# EAGLE design Boron_Feather32_Soil Carrier 200 19Apr2020c (EAGLE 9.6.0)

## Sheet 1 of 3: Sensors
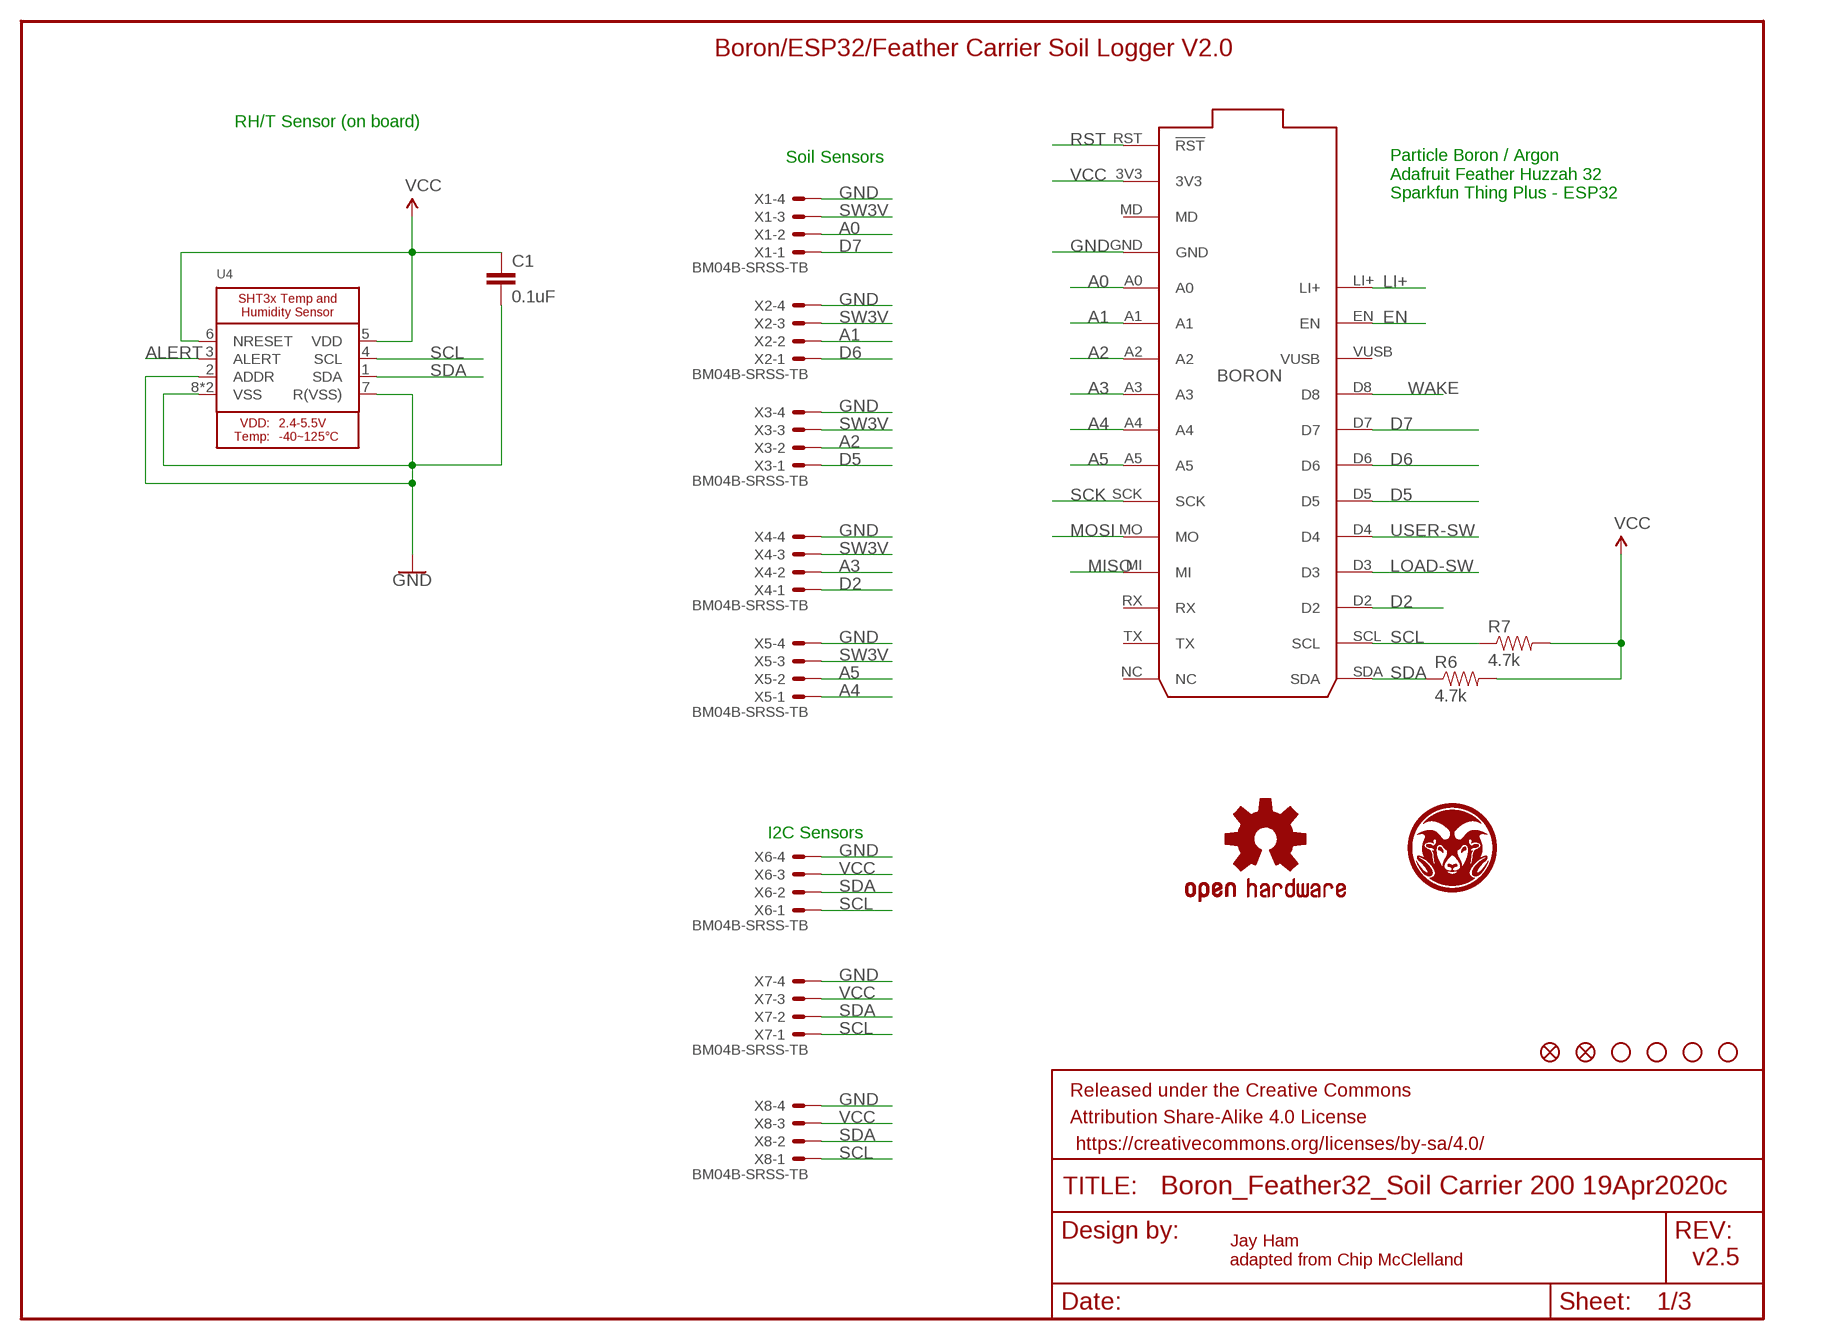
[diagram p0: schematic, sheet 1]

### Parts
BORON  PARTICLE-DEVICES-BORON  [PARTICLE-DEVICES_BORON]
C1  0.1uF  CAP0805  [0805]
FD1  FIDUCIALUFIDUCIAL  [FIDUCIAL-MICRO]
FD2  FIDUCIALUFIDUCIAL  [FIDUCIAL-MICRO]
FRAME1  FRAME-LETTER  [CREATIVE_COMMONS]
JP10  STAND-OFF  [STAND-OFF]
JP11  STAND-OFF  [STAND-OFF]
JP12  STAND-OFF  [STAND-OFF]
JP13  STAND-OFF  [STAND-OFF]
LOGO1  OSHW-LOGOM  [OSHW-LOGO-M]
R6  4.7k  RESISTOR0805-RES  [0805]
R7  4.7k  RESISTOR0805-RES  [0805]
U4  MICROBUILDER_SHT3X  [MICROBUILDER_SHT3X]
U$1  CSU-RAM-LOGO7MM  [CSU-RAM-7MM]
X1  BM04B-SRSS-TB  [BM04B-SRSS-TB]
X2  BM04B-SRSS-TB  [BM04B-SRSS-TB]
X3  BM04B-SRSS-TB  [BM04B-SRSS-TB]
X4  BM04B-SRSS-TB  [BM04B-SRSS-TB]
X5  BM04B-SRSS-TB  [BM04B-SRSS-TB]
X6  BM04B-SRSS-TB  [BM04B-SRSS-TB]
X7  BM04B-SRSS-TB  [BM04B-SRSS-TB]
X8  BM04B-SRSS-TB  [BM04B-SRSS-TB]

### Nets
A0: BORON.A0 X1.2
A1: BORON.A1 X2.2
A2: BORON.A2 X3.2
A3: BORON.A3 X4.2
A4: BORON.A4 X5.1
A5: BORON.A5 X5.2
ALERT: U4.3(ALERT)
D2: BORON.D2 X4.1
D5: BORON.D5 X3.1
D6: BORON.D6 X2.1
D7: BORON.D7 X1.1
EN: BORON.EN ; also sheet 3
GND [supply]: BORON.GND C1.2 U4.2(ADDR) U4.7(R(VSS)) U4.8(VSS) U4.THERMAL(VSS) X1.4 X2.4 X3.4 X4.4 X5.4 X6.4 X7.4 X8.4 ; also sheet 2,3
LI+ [supply]: BORON.LI+ ; also sheet 2
LOAD-SW: BORON.D3 ; also sheet 2,3
MISO: BORON.MI
MOSI: BORON.MO
RST: BORON.RST(!RST) ; also sheet 3
SCK: BORON.SCK
SCL: BORON.SCL R7.1 U4.4(SCL) X6.1 X7.1 X8.1 ; also sheet 2,3
SDA: BORON.SDA R6.1 U4.1(SDA) X6.2 X7.2 X8.2 ; also sheet 2,3
SW3V [supply]: X1.3 X2.3 X3.3 X4.3 X5.3 ; also sheet 2
USER-SW: BORON.D4 ; also sheet 2
VCC: BORON.3V3 C1.1 R6.2 R7.2 U4.5(VDD) U4.6(NRESET) X6.3 X7.3 X8.3 ; also sheet 2,3
WAKE: BORON.D8 ; also sheet 3
Unconnected: BORON.MD BORON.NC BORON.RX BORON.TX BORON.VUSB

### Notes on the sheet
- Boron/ESP32/Feather Carrier Soil Logger V2.0
- RH/T Sensor (on board)
- Soil Sensors
- Particle Boron / Argon
  Adafruit Feather Huzzah 32
  Sparkfun Thing Plus - ESP32
- I2C Sensors
- Jay Ham
  adapted from Chip McClelland
- v2.5

## Sheet 2 of 3: Power Control
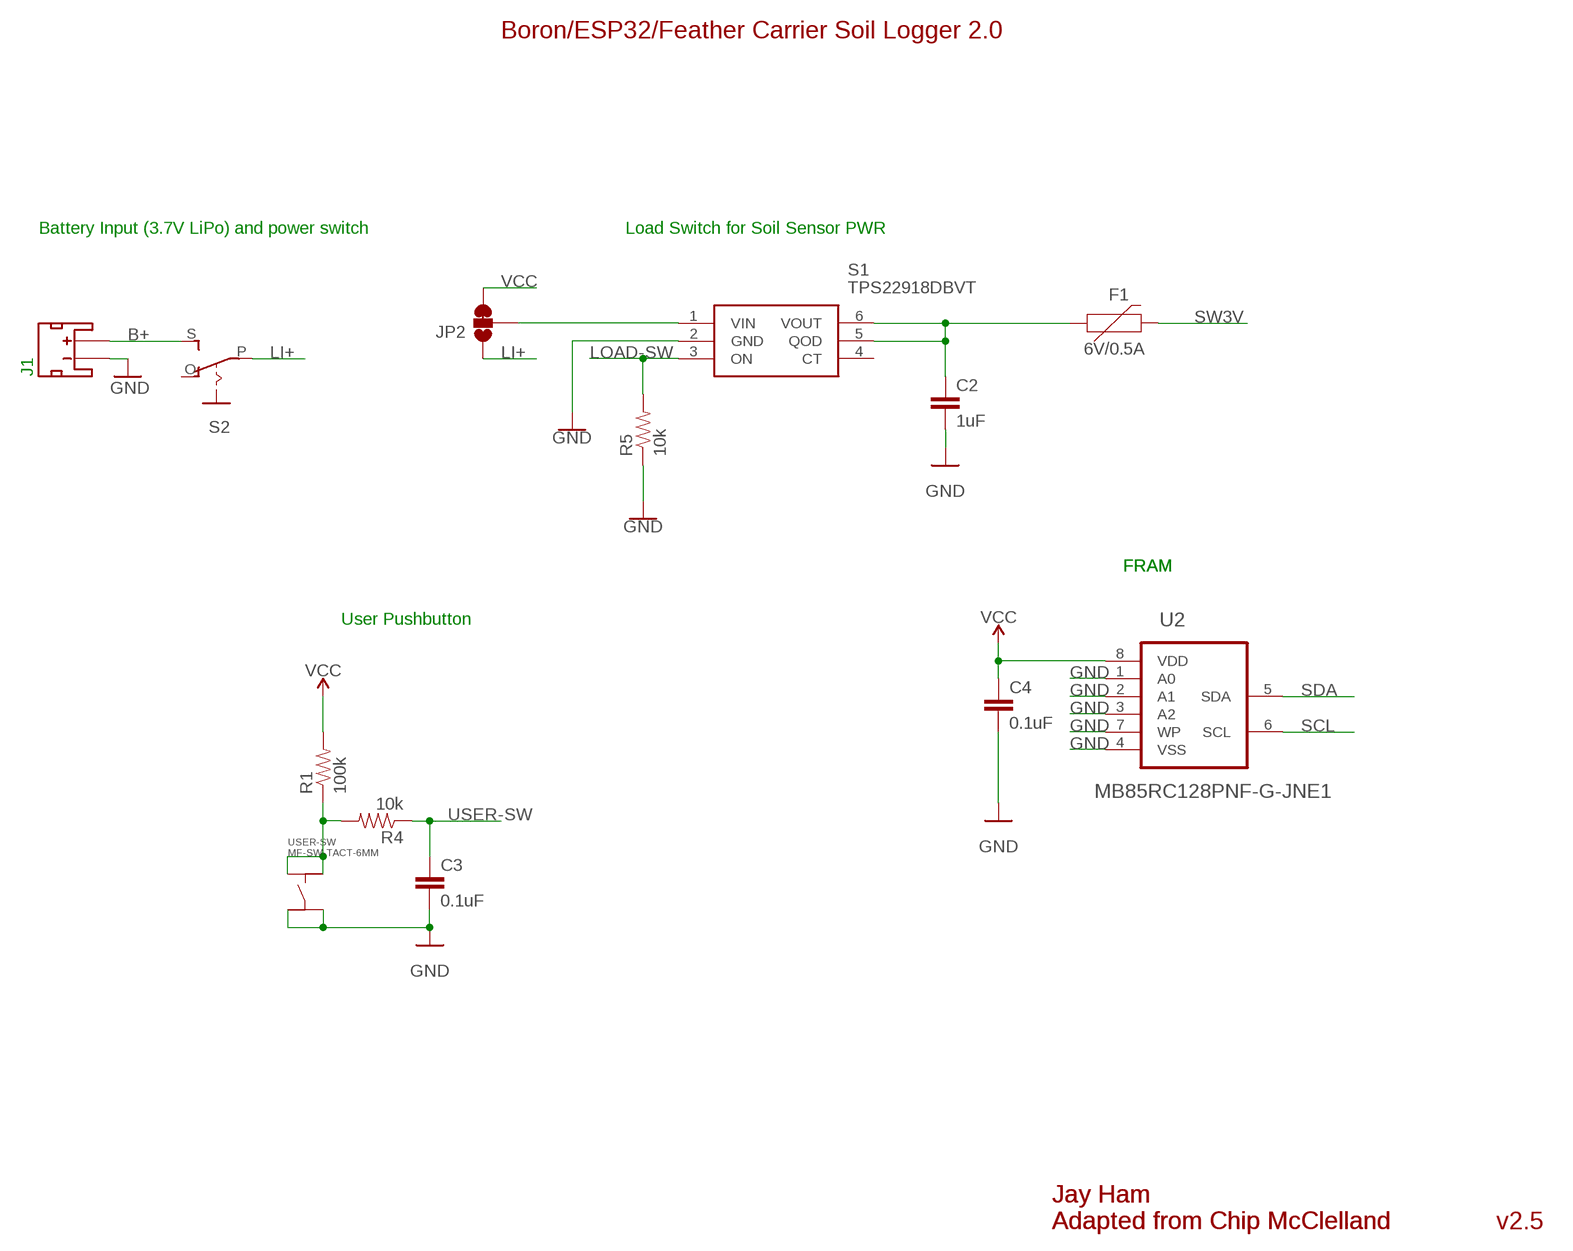
[diagram p1: schematic, sheet 2]

### Parts
C2  1uF  CAP0805  [0805]
C3  0.1uF  CAP0805  [0805]
C4  0.1uF  CAP0805  [0805]
F1  6V/0.5A  PPTC_HALF-AMP  [1206]
J1  S2B-PH-SM4-TB(LF)(SN)  JST_2MM_MALE  [JST-2-SMD]
JP2  JUMPER-SMT_3_1-NC_TRACE_NO-SILK  [SMT-JUMPER_3_1-NC_TRACE_NO-SILK]
R1  100k  RESISTOR0805-RES  [0805]
R4  10k  RESISTOR0805-RES  [0805]
R5  10k  RESISTOR0805-RES  [0805]
S1  TPS22918DBVT  [SOT95P280X145-6N]
S2  EG1218S  [EG1218]
U2  MB85RC128PNF-G-JNE1  FUJITSU_BY_ELEMENT14_BATCH_1_MB85RC128PNF-G-JNE1  [FUJITSU_BY_ELEMENT14_BATCH_1_SOIC127P600X175-8N]
USER-SW  MF-SW-TACT-6MM  MF_SWITCHES_TACT_6MM  [MF_SWITCHES_TACT6MM]

### Nets
B+: J1.2(+) S2.S ; also sheet 3
GND [supply]: C2.2 C3.2 C4.2 J1.1(-) R5.1 S1.2(GND) U2.1(A0) U2.2(A1) U2.3(A2) U2.4(VSS) U2.7(WP) USER-SW.P$3 USER-SW.P$4 ; also sheet 1,3
LI+ [supply]: JP2.1 S2.P ; also sheet 1
LOAD-SW: R5.2 S1.3(ON) ; also sheet 1,3
N$3: JP2.2 S1.1(VIN)
N$4: R1.1 R4.2 USER-SW.P$1 USER-SW.P$2
N$5: C2.1 F1.1 S1.5(QOD) S1.6(VOUT)
SCL: U2.6(SCL) ; also sheet 1,3
SDA: U2.5(SDA) ; also sheet 1,3
SW3V [supply]: F1.2 ; also sheet 1
USER-SW: C3.1 R4.1 ; also sheet 1
VCC: C4.1 JP2.3 R1.2 U2.8(VDD) ; also sheet 1,3
Unconnected: J1.NC1(PAD1) J1.NC2(PAD2) S1.4(CT) S2.O

### Notes on the sheet
- Boron/ESP32/Feather Carrier Soil Logger 2.0
- Battery Input (3.7V LiPo) and power switch | Load Switch for Soil Sensor PWR
- FRAM | FRAM
- User Pushbutton
- Jay Ham
  Adapted from Chip McClelland
- Jay Ham
  Adapted from Chip McClelland
- v2.5

## Sheet 3 of 3: RTC and Watchdog
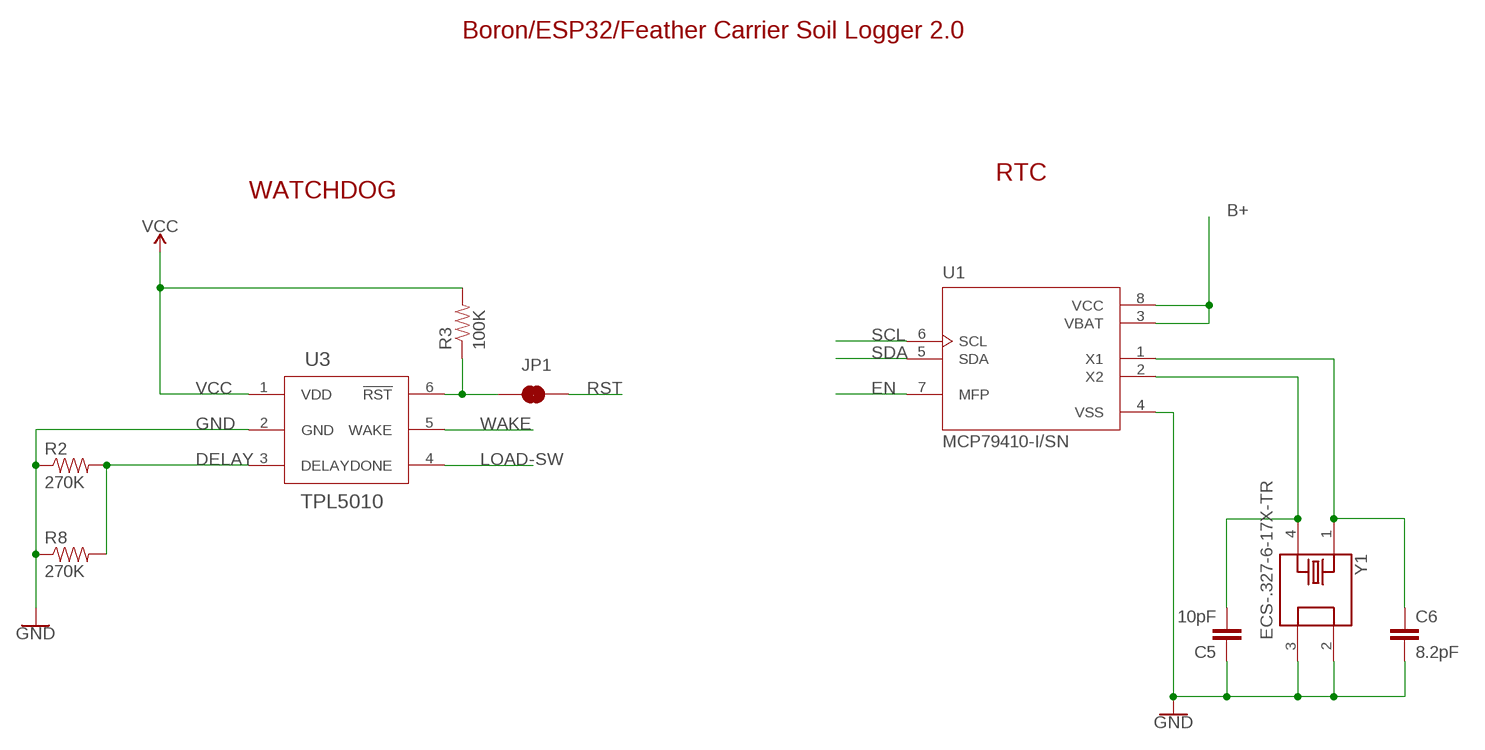
[diagram p2: schematic, sheet 3]

### Parts
C5  10pF  SPARKFUN-CAPACITORS_CAP0805  [SPARKFUN-CAPACITORS_0805$1]
C6  8.2pF  SPARKFUN-CAPACITORS_CAP0805  [SPARKFUN-CAPACITORS_0805$1]
JP1  JUMPER-SMT_2_NC_TRACE_NO-SILK  [SMT-JUMPER_2_NC_TRACE_NO-SILK]
R2  270K  SPARKFUN-PASSIVES_RESISTOR0805-RES  [SPARKFUN-PASSIVES_0805]
R3  100K  SPARKFUN-PASSIVES_RESISTOR0805-RES  [SPARKFUN-PASSIVES_0805]
R8  270K  SPARKFUN-PASSIVES_RESISTOR0805-RES  [SPARKFUN-PASSIVES_0805]
U1  MCP79410-I/SN  [SOIC127P600X175-8N]
U3  TPL5010  CUSTOM-COMPONENTS_TPL5010  [CUSTOM-COMPONENTS_TSOT-23]
Y1  ECS-.327-6-17X-TR  CUSTOM-COMPONENTS_ECS-.327-6-17X-TR  [CUSTOM-COMPONENTS_XTAL_ECS-.327-6-17X-TR]

### Nets
B+: U1.3(VBAT) U1.8(VCC) ; also sheet 2
DELAY: R2.2 R8.2 U3.3(DELAY)
EN: U1.7(MFP) ; also sheet 1
GND [supply]: C5.1 C6.2 R2.1 R8.1 U1.4(VSS) U3.2(GND) Y1.2 Y1.3 ; also sheet 1,2
LOAD-SW: U3.4(DONE) ; also sheet 1,2
N$1: C5.2 U1.2(X2) Y1.4
N$2: C6.1 U1.1(X1) Y1.1
N$6: JP1.2 R3.1 U3.6(!RST)
RST: JP1.1 ; also sheet 1
SCL: U1.6(SCL) ; also sheet 1,2
SDA: U1.5(SDA) ; also sheet 1,2
VCC: R3.2 U3.1(VDD) ; also sheet 1,2
WAKE: U3.5(WAKE) ; also sheet 1

### Notes on the sheet
- Boron/ESP32/Feather Carrier Soil Logger 2.0
- RTC
- WATCHDOG

## Library data of the parts
BORON = Carrier Board:PARTICLE-DEVICES-BORON: Particle Boron Device for Carrier Board Placement
C1-C4 = SparkFun-Passives:CAP: Capacitor Standard 0603 ceramic capacitor, and 0.1" leaded capacitor.
C5 C6 = Carrier Board:SPARKFUN-CAPACITORS_CAP: Capacitor Standard 0603 ceramic capacitor, and 0.1" leaded capacitor.
F1 = SparkFun-Fuses:PPTC: Resettable Fuse PPTC Resettable Fuse. Really a sort of resistor with a polymeric positive temperature coefficient whose resistance increases dramatically with an increase in temperature. When heated by the power passing through the resistance rises causing the current to be limited, protecting the circuit. This is achieved by the transition of the polymer from a crystalline to an amorphous state where the conductive carbon separates breaking the conductive pathways found in the cool crystalline structure. When a PPTC cools back down it resumes conducting letting the circuit turn back on. SparkFun Products: SparkFun RedBoard - Programmed with Arduino <https://www.sparkfun.com/products/12757> Pro Micro - 5V/16MHz <https://www.sparkfun.com/products/12640> Arduino Pro 328 - 5V/16MHz <https://www.sparkfun.com/products/10915> MP3 Trigger <https://www.sparkfun.com/products/13720>; PROD_ID: RES-08585
FD1 FD2 = SparkFun-Aesthetics:FIDUCIAL: Fiducial Alignment Points Point-of-reference for pick-and-place machines and other optical instruments.
FRAME1 = SparkFun-Aesthetics:FRAME-LETTER: Schematic Frame - Letter Standard 8.5x11 US Letter frame
J1 = SparkFun-Connectors:JST_2MM_MALE: JST 2MM MALE RA CONNECTOR Two pin, compact surface mount connector. Commonly used as a battery input connection point. We really like the solid locking feeling and high current rating on these small connectors. We use these all the time as battery connectors. Mates to single-cell LiPo batteries. Here is the connector we sell at SparkFun: JST Right Angle Connector - White <https://www.sparkfun.com/products/8612> (PRT-08612) Datasheet <http://www.sparkfun.com/datasheets/Prototyping/Connectors/JST-Horizontal.pdf> It was used on these SparkFun products: SparkFun MOSFET Power Controller <https://www.sparkfun.com/products/11214> (PRT-11214) SparkFun Battery Babysitter - LiPo Battery Manager <https://www.sparkfun.com/products/13777> (PRT-13777) And many, many others that required a lipo battery connection.; MFG: S2B-PH-SM4-TB(LF)(SN); PROD_ID: CONN-11443; SF_ID: PRT-08612
JP1 = SparkFun-Jumpers:JUMPER-SMT_2_NC_TRACE: Normally closed trace jumper This jumper has a trace between two pads so it's normally closed (NC). Use a razor knife to open the connection. For best results follow the IPC guidelines for cutting traces: Cutout at least 0.063 mm (0.005 in). Remove all loose material to clean up the cut area. Seal the cut with an approved epoxy. Reapply solder to reclose the connection.
JP2 = SparkFun-Jumpers:JUMPER-SMT_3_1-NC_TRACE: Normally closed trace jumper (1 of 2 connections) This jumper has a trace between two pads so it's normally closed (NC). The other connection is normally open (NO). Use a razor knife to open the connection. For best results follow the IPC guidelines for cutting traces: Cutout at least 0.063 mm (0.005 in). Remove all loose material to clean up the cut area. Seal the cut with an approved epoxy. Reapply solder to reclose the connection, or to close the NO connection.
JP10-JP13 = SparkFun:STAND-OFF: Stand Off This is the mechanical footprint for a #4 phillips button head screw. Use the keepout ring to avoid running the screw head into surrounding components. SKU : PRT-00447
LOGO1 = SparkFun-Aesthetics:OSHW-LOGO: Open-Source Hardware (OSHW) Logo This logo indicates the piece of hardware it is found on incorporates a OSHW license and/or adheres to the definition of open source hardware found here: http://freedomdefined.org/OSHW
R1 R4-R7 = SparkFun-Passives:RESISTOR: Resistor Basic schematic elements and footprints for 0603, 1206, and PTH resistors.
R2 R3 R8 = Carrier Board:SPARKFUN-PASSIVES_RESISTOR: Resistor Basic schematic elements and footprints for 0603, 1206, and PTH resistors.
S1 = TPS22918DBVT:TPS22918DBVT: 5.5V, 2A, 52m Load Switch with Adjustable Rise Time and Adjustable Quick Output Discharge Source: Datasheet <http://www.ti.com/lit/gpn/tps22918>; ARROW_PART_NUMBER: TPS22918DBVT; ARROW_PRICE/STOCK: https://www.arrow.com/en/products/tps22918dbvt/texas-instruments; DESCRIPTION: 5.5V, 2A, 52m Load Switch with Adjustable Rise Time and Adjustable Quick Output Discharge; HEIGHT: 1.45mm; MANUFACTURER_NAME: Texas Instruments; MANUFACTURER_PART_NUMBER: TPS22918DBVT
S2 = adafruit:EG1218: SLIDING SWITCH 0.1" spacing through hole, vertical SPDT slide switch http://www.ladyada.net/library/pcb/eaglelibrary.html
U1 = MCP79410-I_SN:MCP79410-I/SN: MCP79410 Series 5.5 V I2C Real-Time Clock/Calendar with EEPROM SRAM-SOIC-8; AVAILABILITY: Unavailable; DESCRIPTION: MCP79410 Series 5.5 V I2C Real-Time Clock/Calendar with EEPROM SRAM-SOIC-8; MF: Microchip; MP: MCP79410-I/SN; PACKAGE: SO-8 Microchip; PRICE: None
U2 = Carrier Board:FUJITSU_BY_ELEMENT14_BATCH_1_MB85RC128PNF-G-JNE1: Memory FRAM; MPN: MB85RC128PNF-G-JNE1; OC_FARNELL: 1831995; OC_NEWARK: 93R5161; PACKAGE: SO-8; SUPPLIER: FUJITSU
U3 = Carrier Board:CUSTOM-COMPONENTS_TPL5010: This is a TI Ultra-Low-Power External watchdog.
U4 = Adafruit SHT31 Breakout:MICROBUILDER_SHT3X: SHT3x - Digital Temperature and Humidity Sensor Supply Voltage: 2.4-5.5V Humidity Accuracy: SHT30 = +/-3%RH, SHT31 = +/-2%RH Temperature Sensor: -40~125°C (+/-0.3°C from 10-55C)
U$1 = HamLab-Aesthetics:CSU-RAM-LOGO: CSU Ram Logo This is the ram logo for Colorado State University. The logo on the schematic will always be the same size; the package variant is the height of the ram. Default layer for the logo on the board is now tPlace.
USER-SW = Carrier Board:MF_SWITCHES_TACT: Library: MF_Switches Description: Device for Tact Switches. Manufacture part number (MFG#) can be added via Attributes.; HOUSEPART: YES; MPN: MF-SW-TACT-6MM; POPULATE: 1; URL: https://factory.macrofab.com/part/MF-SW-TACT-6MM
X1-X8 = con-jst2:?M04B-SRSS-TB: Disconnectable Crimp style connector, 1.0mm pitch 4 contacts
Y1 = Carrier Board:CUSTOM-COMPONENTS_ECS-.327-6-17X-TR: Crystal 4-SOJ, 5.50mm pitch; DESCRIPTION: ECX-306X Series 32.768 kHz ±20 ppm 6 pF -40 to +85 °C SMT Tuning Fork Crystal; DIGI-KEY_PART_NUMBER: XC1307CT-ND; DIGI-KEY_PURCHASE_URL: https://www.digikey.com/product-detail/en/ecs-inc/ECS-.327-6-17X-TR/XC1307CT-ND/827771?utm_source=snapeda&utm_medium=aggregator&utm_campaign=symbol; MF: ECS Inc.; MP: ECS-.327-6-17X-TR; PACKAGE: 4-4 ECS International

## Net classes
0 default: width 0.203 mm, drill 0.33 mm, clearance 0.203 mm
1 supply: width 0.33 mm, clearance 0.254 mm
2 power: width 0.61 mm, clearance 0.254 mm

## Board
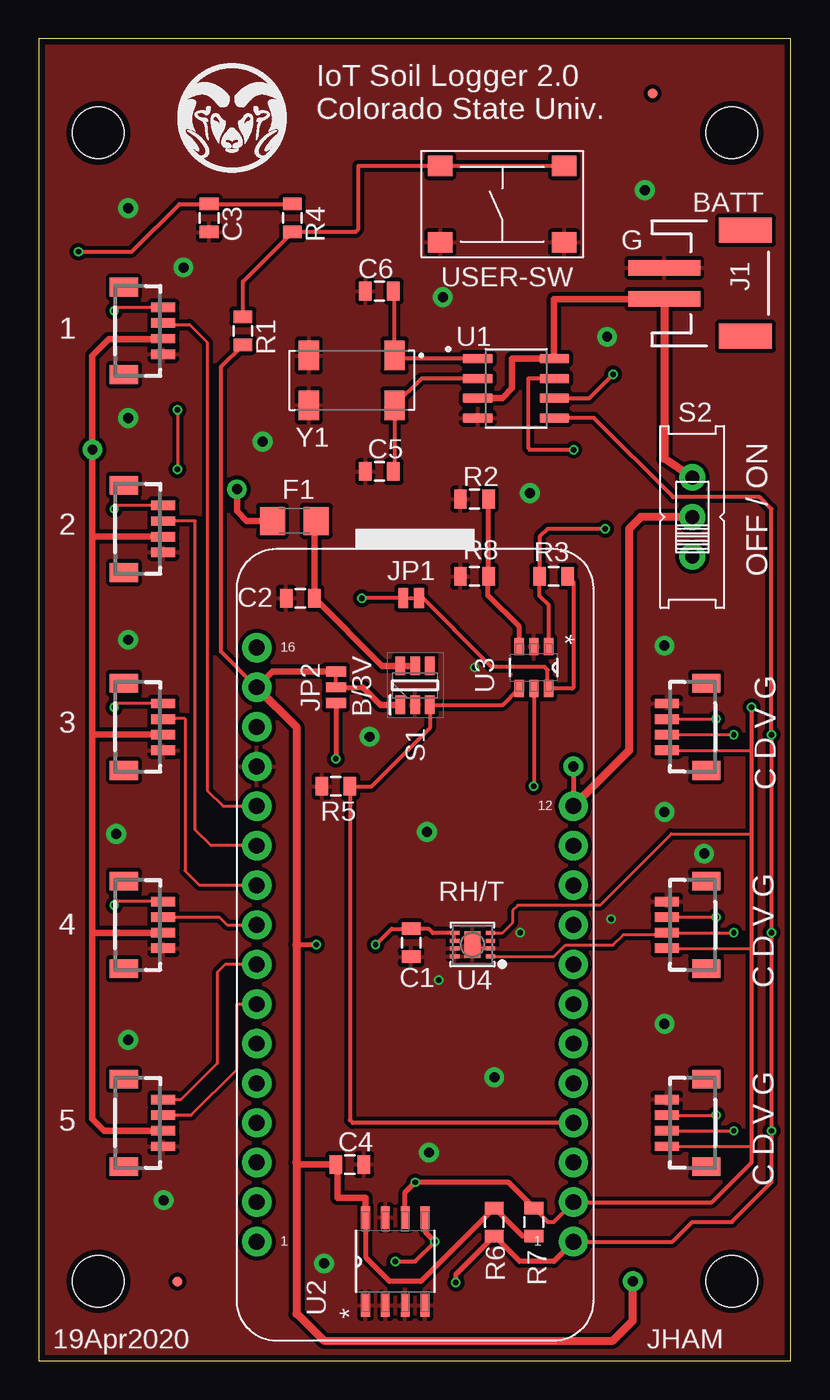
[diagram p3: board, top side]
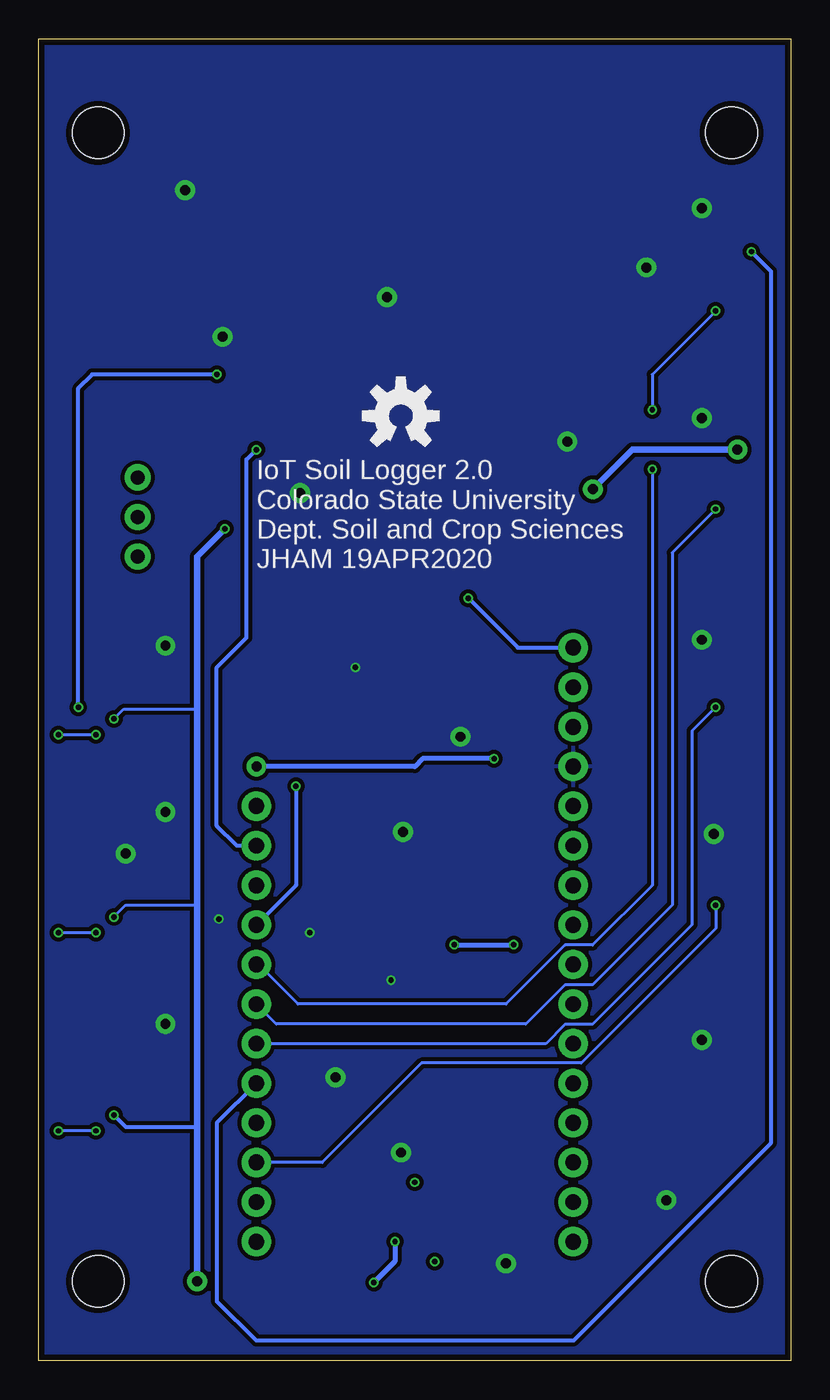
[diagram p4: board, bottom side, seen from below]

Size 48.24 x 84.76 mm. Coordinates in mm from the lower left corner, seen from the top.
Outline: 0,0 48.24,0 48.24,84.76 0,84.76 0,0
Copper layers (1*16): Top 0.035559375mm / dielectric 1.6mm / Bottom 0.035559375mm
Design rules "oshpark-2layer": minimum track width 6mil, minimum drill 10mil, track to track 6mil, track to pad 6mil, pad to pad 6mil, via to via 6mil, smd to smd 6mil, copper to edge 15mil, drill to drill 6mil, minimum pad ring 5mil, minimum via ring 5mil, stop-mask expansion 2.5mil, vias tented up to drill 0mil, thermal gap 10mil

### Footprints (pad centres in the part's own frame; a part is rotated, then mirrored left to right if it is on the bottom)
PARTICLE-DEVICES_BORON = drill 1.016 pad 1.88: 3V3 1.27,41.91; A0 1.27,34.29; A1 1.27,31.75; A2 1.27,29.21; A3 1.27,26.67; A4 1.27,24.13; A5 1.27,21.59; D2 21.59,11.43; D3 21.59,13.97; D4 21.59,16.51; D5 21.59,19.05; D6 21.59,21.59; D7 21.59,24.13; D8 21.59,26.67; EN 21.59,31.75; GND 1.27,36.83; LI+ 21.59,34.29; MD 1.27,39.37; MI 1.27,13.97; MO 1.27,16.51; NC 1.27,6.35; RST 1.27,44.45; RX 1.27,11.43; SCK 1.27,19.05; SCL 21.59,8.89; SDA 21.59,6.35; TX 1.27,8.89; VUSB 21.59,29.21
0805 = smd 0.8 x 1.2: 1 -0.9,0; 2 0.9,0
SPARKFUN-CAPACITORS_0805$1 = smd 0.8 x 1.2: 1 -0.9,0; 2 0.9,0
1206 = smd 1.6 x 1.8: 1 -1.4,0; 2 1.4,0
FIDUCIAL-MICRO = smd 0.635 x 0.635: 1 0,0
JST-2-SMD = smd 1 x 4.6: 1 -1,-3.7; 2 1,-3.7 | smd 1.6 x 3.4: NC1 -3.4,1.5; NC2 3.4,1.5
SMT-JUMPER_2_NC_TRACE_NO-SILK = smd 0.635 x 1.27: 1 -0.508,0; 2 0.508,0
SMT-JUMPER_3_1-NC_TRACE_NO-SILK = smd 0.635 x 1.27: 1 -1.016,0; 2 0,0; 3 1.016,0
STAND-OFF = hole 3.302: 0,0
SPARKFUN-PASSIVES_0805 = smd 0.8 x 1.2: 1 -0.9,0; 2 0.9,0
SOT95P280X145-6N = smd 1.2 x 0.6: 1 -1.25,0.95; 2 -1.25,0; 3 -1.25,-0.95; 4 1.25,-0.95; 5 1.25,0; 6 1.25,0.95
EG1218 = drill 0.9 pad 1.676: O -2.54,0; P 0,0; S 2.54,0
SOIC127P600X175-8N = smd 1.9 x 0.6: 1 -2.455,1.905; 2 -2.455,0.635; 3 -2.455,-0.635; 4 -2.455,-1.905; 5 2.455,-1.905; 6 2.455,-0.635; 7 2.455,0.635; 8 2.455,1.905
FUJITSU_BY_ELEMENT14_BATCH_1_SOIC127P600X175-8N = smd 1.473 x 0.559: 1 -2.819,1.905; 2 -2.819,0.635; 3 -2.819,-0.635; 4 -2.819,-1.905; 5 2.819,-1.905; 6 2.819,-0.635; 7 2.819,0.635; 8 2.819,1.905
CUSTOM-COMPONENTS_TSOT-23 = smd 1.1 x 0.6: 1 -1.35,0.95; 2 -1.35,0; 3 -1.35,-0.94; 4 1.35,-0.95; 5 1.35,0; 6 1.35,0.95
MICROBUILDER_SHT3X = smd 0.6 x 0.25: 1 -1.15,0.75; 2 -1.15,0.25; 3 -1.15,-0.25; 4 -1.15,-0.75; 5 1.15,-0.75; 6 1.15,-0.25; 7 1.15,0.25; 8 1.15,0.75 | smd 1 x 1.7: THERMAL 0,0
MF_SWITCHES_TACT6MM = smd 1.55 x 1.3: P$1 -3.975,2.45; P$2 3.975,2.45; P$3 -3.975,-2.45; P$4 3.975,-2.45
BM04B-SRSS-TB = smd 0.6 x 1.55: 1 1.5,-1.625; 2 0.5,-1.625; 3 -0.5,-1.625; 4 -1.5,-1.625 | smd 1.2 x 1.8: FIT@1 2.8,0.9; FIT@2 -2.8,0.9
CUSTOM-COMPONENTS_XTAL_ECS-.327-6-17X-TR = smd 1.3 x 1.9: 1 -2.75,-1.6; 2 2.75,-1.6; 3 2.75,1.6; 4 -2.75,1.6

### Placement (x,y rotation side)
BORON  12.7,1.27 0 top
C1  23.88,26.8 270 top
C2  16.76,48.9 180 top
C3  10.92,73.28 270 top
C4  19.94,12.57 0 top
C5  21.84,57.02 0 top
C6  21.84,68.58 180 top
F1  16.38,53.85 180 top
FD1  8.89,5.08 0 top
FD2  39.37,81.28 0 top
FRAME1  0,-11.43 0 top  (outside the outline)
J1  43.81,69.09 270 top
JP1  23.88,48.9 0 top
JP2  19.05,43.18 90 top
JP10  44.45,5.08 0 top
JP11  3.81,5.08 0 top
JP12  44.45,78.74 0 top
JP13  3.81,78.74 0 top
LOGO1  25.02,60.58 0 bottom
R1  13.08,66.04 270 top
R2  27.94,55.24 0 top
R3  33.02,50.29 180 top
R4  16.26,73.28 270 top
R5  19.05,36.83 0 top
R6  29.21,8.89 90 top
R7  31.75,8.89 270 top
R8  27.94,50.29 0 top
S1  24.13,43.31 90 top
S2  41.91,54.1 90 top
U1  30.61,62.36 0 top
U2  22.86,6.35 90 top
U3  31.75,44.45 270 top
U4  27.81,26.67 180 top
U$1  8.89,76.2 0 top
USER-SW  29.72,74.17 0 top
X1  6.35,66.04 90 top
X2  6.35,53.34 90 top
X3  6.35,40.64 90 top
X4  6.35,27.94 90 top
X5  6.35,15.24 90 top
X6  41.91,40.64 270 top
X7  41.91,27.94 270 top
X8  41.91,15.24 270 top
Y1  20.07,62.87 180 top

### Tracks (layer width: path | path; a pad name or v marks a point on that pad's centre or on a via)
A0
  Top 0.203: X1.2 8.07,66.45 9.66,66.45 10.79,65.31 10.79,59.69 10.79,36.58 11.81,35.56 BORON.A0
A1
  Top 0.203: BORON.A1 11.05,33.02 10.03,34.04 10.03,53.85 X2.2
A2
  Top 0.203: X3.2 8.01,41.18 9.37,41.18 9.37,31.41 10.3,30.48 BORON.A2
A3
  Top 0.203: X4.2 11.57,28.44 12.07,27.94 BORON.A3
A4
  Top 0.203: X5.1 9.12,16.74 11.43,19.05 11.43,24.89 11.94,25.4 BORON.A4
A5
  Top 0.203: X5.2 7.99,15.75 9.77,15.75 12.7,18.69 12.7,22.86 BORON.A5
B+
  Top 0.254: U1.8 33.02,64.3 | 30.39,64.26 30.35,64.26
  Top 0.406: 33.02,64.3 33.02,68.09 J1.2 | U1.3 29.72,61.72 30.35,62.36 30.35,64.26 | 30.39,64.26 U1.8
  Top 0.508: S2.S 40.11,57.84 J1.2
D2  (via drill 0.35)
  Top 0.203: X4.1 5.06,29.44 v4.83,29.21
  Bottom 0.203: BORON.D2 30.07,12.7 23.69,19.07 13.45,19.07 4.83,27.7 v4.83,29.21
D5  (via drill 0.35)
  Top 0.203: X3.1 5.06,42.14 v4.83,41.91
  Bottom 0.203: BORON.D5 15.73,20.32 14.49,21.57 12.72,21.57 6.35,27.94 6.35,40.39 v4.83,41.91
D6  (via drill 0.35)
  Top 0.203: X2.1 5.06,54.84 v4.83,54.61
  Bottom 0.203: BORON.D6 33.02,21.59 17,21.59 14.49,24.11 12.72,24.11 7.62,29.21 7.62,51.82 v4.83,54.61
D7  (via drill 0.35)
  Top 0.203: X1.1 5.06,67.54 v4.83,67.31 | v8.89,60.96 v8.89,57.15
  Bottom 0.203: BORON.D7 34.16,25.4 31.62,22.86 18.27,22.86 14.49,26.64 12.72,26.64 8.89,30.48 v8.89,57.15 | v4.83,67.31 8.89,63.25 v8.89,60.96
DELAY
  Top 0.33: U3.3 30.81,47.07 28.78,49.1 28.78,50.23 R8.2 R2.2
EN  (via drill 0.35)
  Top 0.254: U1.7 31.41,62.99 31.37,62.95 31.37,58.55 31.5,58.42 v34.29,58.42
  Bottom 0.254: v34.29,58.42 34.92,57.79 34.92,46.36 36.83,44.45 36.83,34.29 35.56,33.02 BORON.EN
GND  (via drill 0.35, 0.64 pad 1.27)
  Top 0.203: U4.2 28.06,26.42
  Top 0.33: 28.06,26.42 U4.THERMAL
  other vias: 27.94,44.45 30.86,27.43 36.7,28.32 40.13,35.18 4.95,33.78 5.71,20.57 8,10.29 5.71,46.23 5.71,60.45 5.71,73.91 40.13,45.85 40.13,21.59 42.67,32.51 38.86,75.06 24.89,33.91 25.02,13.34 25.91,68.2 36.45,65.66 9.27,70.1 29.21,18.16 21.21,40.01 31.5,55.63 14.35,58.93 18.29,6.22 25.65,24.38
  pour Bottom: -1.27,86.36 -1.27,-1.27 49.53,-1.27 49.53,86.36
  pour Top: -2.54,87.63 -2.54,-2.54 50.8,-2.54 50.8,87.63
LI+  (via drill 0.35, 0.64 pad 1.27)
  Top 0.33: v34.29,38.1 BORON.LI+ | JP2.1 v19.05,38.61
  Top 0.508: S2.P 38.61,54.1 37.85,53.34 37.85,39.12 BORON.LI+
  Bottom 0.33: v34.29,38.1 24.13,38.1 23.62,38.61 v19.05,38.61
LOAD-SW
  Top 0.254: BORON.D3 20.14,15.24 19.95,15.43 R5.2 21.35,36.83 25.08,40.56 S1.3 29.76,42.06 U3.4
N$1
  Top 0.254: U1.2 24.54,62.99 Y1.4 22.82,57.09 C5.2
N$2
  Top 0.254: U1.1 23.02,64.26 Y1.1 22.82,68.51 C6.1
N$3
  Top 0.33: JP2.2 20.79,43.18
  Top 0.406: S1.1 21.91,42.06 20.79,43.18
N$4
  Top 0.254: USER-SW.P$2 USER-SW.P$1 20.5,76.62 20.5,72.56 20.32,72.39 R4.2 13.08,69.2 R1.1
N$5
  Top 0.406: S1.5 S1.6 22,44.56 C2.1 17.66,53.73 F1.1
N$6
  Top 0.254: JP1.2 24.64,48.9 26.62,46.91 26.62,46.89 29.03,44.49 32.44,44.49 32.63,44.3 32.63,43.17 U3.6 34.21,43.1 34.29,43.18 34.29,49.92 R3.1
RST  (via drill 0.35)
  Top 0.254: JP1.1 v20.7,48.9
  Bottom 0.254: v20.7,48.9 17.53,45.72 BORON.RST
SCL  (via drill 0.35)
  Top 0.203: X6.1 45.7,39.14 45.72,39.12 | X7.1 45.7,26.44 45.72,26.42 | X8.1 45.7,13.74 45.72,13.72 | 45.72,33.78 40.56,33.78 35.97,29.2 30.72,29.2 30.39,28.86 30.39,28.08 29.73,27.42 U4.4
  Top 0.254: v45.72,41.91 45.72,39.12 45.72,33.78 45.72,26.42 45.72,13.72 45.72,12.7 43.18,10.16 BORON.SCL 33.02,8.89 32.65,8.89 R7.1 | U1.6 35.31,61.72 v36.83,63.25
  Top 0.33: U2.6 23.5,10.79 v24.13,11.43 30.11,11.43 R7.1
  Bottom 0.254: v45.72,41.91 45.72,62.36 44.83,63.25 v36.83,63.25
SDA  (via drill 0.35)
  Top 0.203: X8.2 44.57,14.74 v44.58,14.73 | v44.58,27.43 44.57,27.44 X7.2 40.14,27.3 37.48,27.3 36.82,26.64 33.77,26.64 33.05,25.92 U4.1 | X6.2 44.57,40.14 v44.58,40.13
  Top 0.254: BORON.SDA 40.64,7.62 41.91,8.89 44.45,8.89 46.99,11.43 v46.99,14.73 v46.99,27.43 v46.99,40.13 46.99,54.61 46.23,55.37 40.68,55.37 35.6,60.45 U1.5 | v25.4,7.62 24.13,6.35 v22.86,6.35
  Top 0.33: U2.5 24.77,8.26 v25.4,7.62 | BORON.SDA 33.02,6.35 30.85,6.35 R6.1 26.75,5.53 v26.75,5
  Bottom 0.203: v44.58,14.73 v46.99,14.73 | v44.58,27.43 v46.99,27.43 | v44.58,40.13 v46.99,40.13
  Bottom 0.33: v26.75,5 25.4,6.35 v25.4,7.62
SW3V  (via drill 0.64 pad 1.27)
  Top 0.33: X1.3 7.95,65.51 | 3.44,40.14 3.43,40.13 | 3.44,27.44 3.43,27.43 | 3.44,52.84 3.43,52.83
  Top 0.406: 7.95,65.51 4.48,65.51 3.43,64.46 v3.43,58.42 3.43,52.83 3.43,40.13 3.43,27.43 3.43,15.49 4.18,14.74 X5.3 | X3.3 3.44,40.14 | X4.3 3.44,27.44 | F1.2 13.33,53.85 12.7,54.48 v12.7,55.88 | X2.3 3.44,52.84
  Bottom 0.406: v12.7,55.88 10.16,58.42 v3.43,58.42
USER-SW  (via drill 0.35)
  Top 0.254: R4.1 C3.1 9.02,74.18 5.96,71.12 v2.54,71.12
  Bottom 0.254: BORON.D4 36.83,15.24 36.83,3.81 34.29,1.27 13.97,1.27 1.27,13.97 1.27,69.85 v2.54,71.12
VCC  (via drill 0.35, 0.64 pad 1.27)
  Top 0.203: X8.3 v43.43,15.74 v43.43,15.75 | X7.3 v43.43,28.44 v43.43,28.45 | X6.3 v43.43,41.14 v43.43,41.15 | U4.6 U4.5
  Top 0.254: 16.51,2.98 16.55,3.01 | R1.2 11.68,63.74 11.68,45.47 BORON.3V3 | 16.64,12.57 16.51,12.7 | C4.1 19.14,12.47 | v36.32,53.34 32.63,53.34 32.12,52.83 R3.2 32.12,49.03 32.7,48.45 U3.1 | U4.5 25.27,27.42 25.01,27.67 23.9,27.67 C1.1 22.62,27.7 v21.59,26.67
  Top 0.33: R7.2 31.01,7.99 R6.2 24.5,5.08 22.5,5.08 20.96,6.63 U2.8 | v17.78,26.67 16.51,26.67
  Top 0.406: U2.8 20.96,10.44 19.14,10.44 19.14,12.47 | C4.1 16.64,12.57 | JP2.3 14.99,44.2 BORON.3V3
  Top 0.508: BORON.3V3 16.51,40.64 16.51,26.67 16.51,12.7 16.51,2.98 | v38.1,5.08 38.1,2.54 36.83,1.27 18.29,1.27 16.55,3.01
  Bottom 0.203: v43.43,28.45 42.67,29.21 38.1,29.21 | v43.43,41.15 42.8,41.78 38.1,41.78
  Bottom 0.254: v43.43,15.75 42.67,14.99 38.1,14.99
  Bottom 0.33: v21.59,26.67 v17.78,26.67
  Bottom 0.406: v38.1,5.08 38.1,14.99 38.1,29.21 38.1,41.78 38.1,51.56 v36.32,53.34
WAKE  (via drill 0.35)
  Top 0.254: U3.5 v31.75,36.83
  Bottom 0.254: v31.75,36.83 31.75,30.48 BORON.D8

### Text on the board
tPlace: IoT Soil Logger 2.0 / Colorado State Univ. | BATT | G | 1 | 2 | OFF / ON | C D V G | B/3V | 3 | RH/T | C D V G | 4 | C D V G | 5 | 19Apr2020 | JHAM
bPlace: IoT Soil Logger 2.0 / Colorado State University / Dept. Soil and Crop Sciences / JHAM 19APR2020